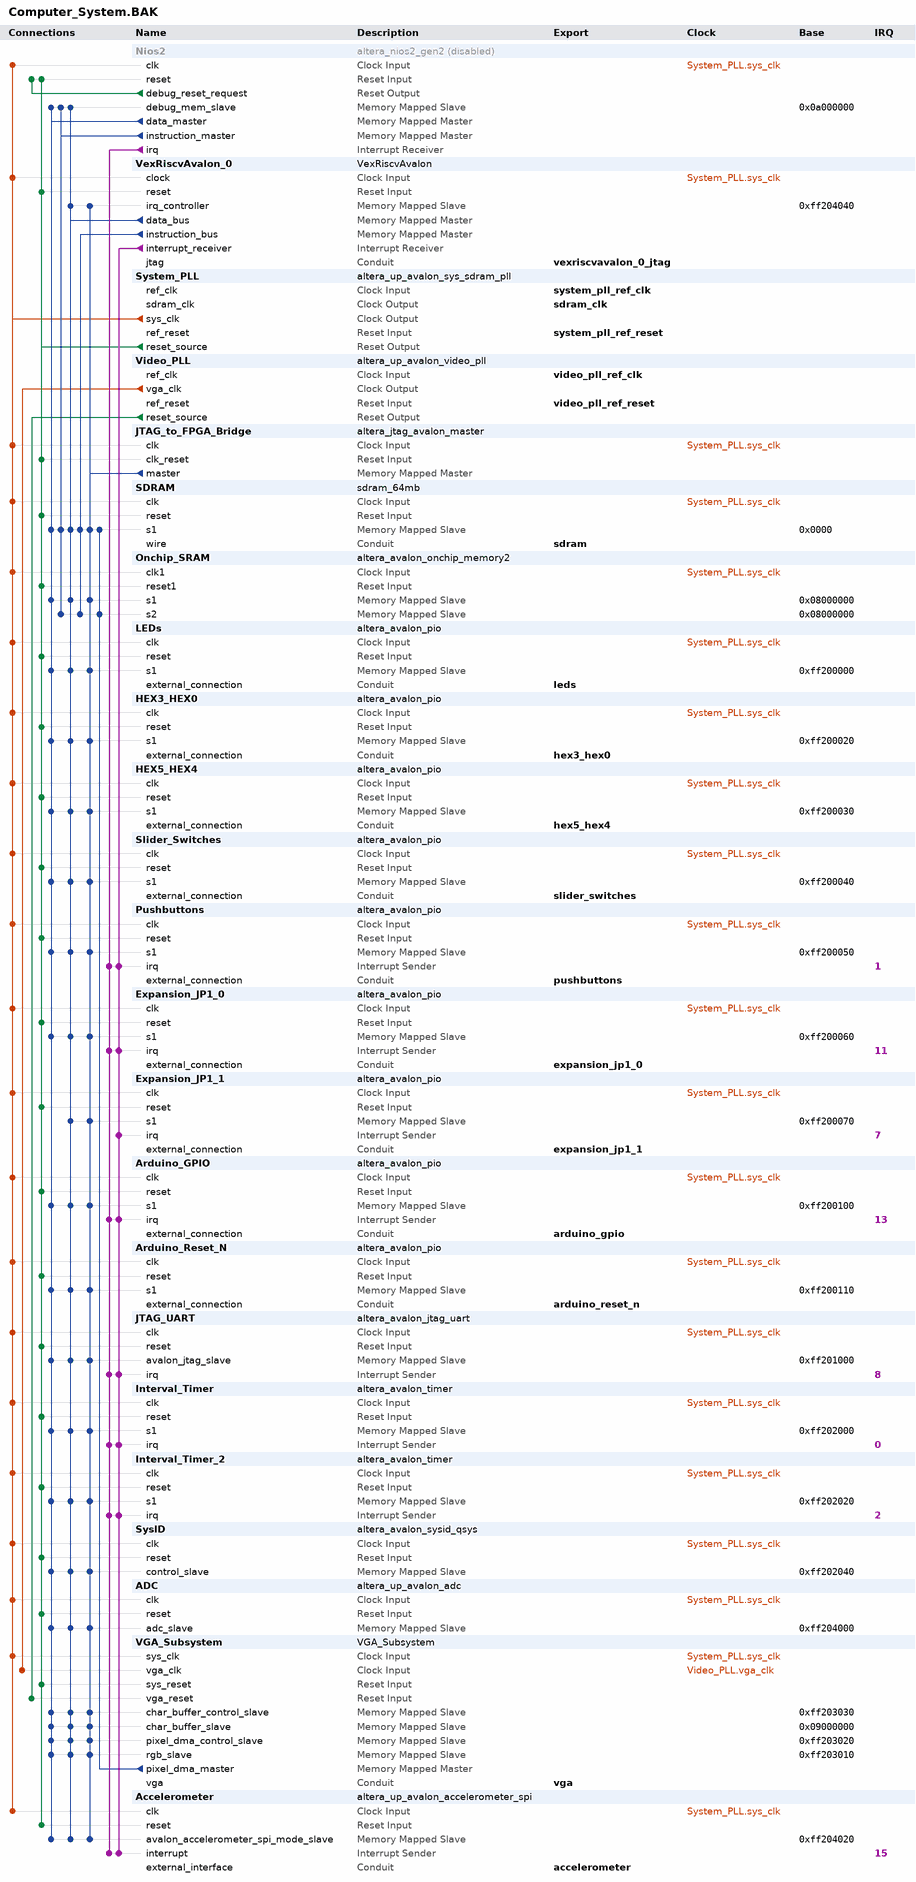
[diagram p0: system contents]
# Platform Designer (Qsys) system Computer_System.BAK, MAX 10 10M50DAF484C6GES
# Parameters at their usual value, and those the tool derives, are not listed.
package require -exact qsys 21.1
create_system Computer_System.BAK
set_project_property DEVICE_FAMILY {MAX 10}
set_project_property DEVICE 10M50DAF484C6GES

add_instance Nios2 altera_nios2_gen2 21.1
set_instance_property Nios2 ENABLED false
set_instance_parameter_value Nios2 dcache_size 0
set_instance_parameter_value Nios2 debug_datatrigger 2
set_instance_parameter_value Nios2 debug_hwbreakpoint 2
set_instance_parameter_value Nios2 debug_traceType instruction_trace
set_instance_parameter_value Nios2 dividerType srt2
set_instance_parameter_value Nios2 exceptionSlave SDRAM.s1
set_instance_parameter_value Nios2 icache_size 4096
set_instance_parameter_value Nios2 impl Fast
set_instance_parameter_value Nios2 mul_64_impl 1
set_instance_parameter_value Nios2 mul_shift_choice 1
set_instance_parameter_value Nios2 resetSlave SDRAM.s1
set_instance_parameter_value Nios2 resetrequest_enabled false
set_instance_parameter_value Nios2 setting_support31bitdcachebypass false

add_instance VexRiscvAvalon_0 VexRiscvAvalon 1.0
set_instance_parameter_value VexRiscvAvalon_0 CORE_CONFIG 4
set_instance_parameter_value VexRiscvAvalon_0 C_EXCEPTION_VECTOR 134217760
set_instance_parameter_value VexRiscvAvalon_0 C_IO_BEGIN 150994944
set_instance_parameter_value VexRiscvAvalon_0 C_IO_END 4294967295
set_instance_parameter_value VexRiscvAvalon_0 C_RESET_VECTOR 134217744

add_instance System_PLL altera_up_avalon_sys_sdram_pll 18.0
set_instance_parameter_value System_PLL CV_boards DE10-Standard
set_instance_parameter_value System_PLL gui_outclk 100.0
set_instance_parameter_value System_PLL gui_refclk 50.0

add_instance Video_PLL altera_up_avalon_video_pll 18.0
set_instance_parameter_value Video_PLL camera {5MP Digital Camera (THDB_D5M)}
set_instance_parameter_value Video_PLL gui_refclk 50.0
set_instance_parameter_value Video_PLL lcd {7" LCD on VEEK-MT and MTL/MTL2 Modules}

add_instance JTAG_to_FPGA_Bridge altera_jtag_avalon_master 21.1

add_instance SDRAM sdram_64mb 1.0

add_instance Onchip_SRAM altera_avalon_onchip_memory2 21.1
set_instance_parameter_value Onchip_SRAM dataWidth 32
set_instance_parameter_value Onchip_SRAM dualPort true
set_instance_parameter_value Onchip_SRAM initMemContent true
set_instance_parameter_value Onchip_SRAM initializationFileName bootrom.mif
set_instance_parameter_value Onchip_SRAM memorySize 65536
set_instance_parameter_value Onchip_SRAM singleClockOperation true
set_instance_parameter_value Onchip_SRAM useNonDefaultInitFile true

add_instance LEDs altera_avalon_pio 21.1
set_instance_parameter_value LEDs direction Output
set_instance_parameter_value LEDs width 10

add_instance HEX3_HEX0 altera_avalon_pio 21.1
set_instance_parameter_value HEX3_HEX0 direction Output
set_instance_parameter_value HEX3_HEX0 width 32

add_instance HEX5_HEX4 altera_avalon_pio 21.1
set_instance_parameter_value HEX5_HEX4 direction Output
set_instance_parameter_value HEX5_HEX4 width 16

add_instance Slider_Switches altera_avalon_pio 21.1
set_instance_parameter_value Slider_Switches direction Input
set_instance_parameter_value Slider_Switches simDoTestBenchWiring true
set_instance_parameter_value Slider_Switches width 10

add_instance Pushbuttons altera_avalon_pio 21.1
set_instance_parameter_value Pushbuttons bitClearingEdgeCapReg true
set_instance_parameter_value Pushbuttons captureEdge true
set_instance_parameter_value Pushbuttons direction Input
set_instance_parameter_value Pushbuttons edgeType FALLING
set_instance_parameter_value Pushbuttons generateIRQ true
set_instance_parameter_value Pushbuttons irqType EDGE
set_instance_parameter_value Pushbuttons simDoTestBenchWiring true
set_instance_parameter_value Pushbuttons width 2

add_instance Expansion_JP1_0 altera_avalon_pio 21.1
set_instance_parameter_value Expansion_JP1_0 bitClearingEdgeCapReg true
set_instance_parameter_value Expansion_JP1_0 captureEdge true
set_instance_parameter_value Expansion_JP1_0 direction Bidir
set_instance_parameter_value Expansion_JP1_0 edgeType FALLING
set_instance_parameter_value Expansion_JP1_0 generateIRQ true
set_instance_parameter_value Expansion_JP1_0 irqType EDGE
set_instance_parameter_value Expansion_JP1_0 simDoTestBenchWiring true
set_instance_parameter_value Expansion_JP1_0 width 18

add_instance Expansion_JP1_1 altera_avalon_pio 21.1
set_instance_parameter_value Expansion_JP1_1 bitClearingEdgeCapReg true
set_instance_parameter_value Expansion_JP1_1 captureEdge true
set_instance_parameter_value Expansion_JP1_1 direction Bidir
set_instance_parameter_value Expansion_JP1_1 edgeType FALLING
set_instance_parameter_value Expansion_JP1_1 generateIRQ true
set_instance_parameter_value Expansion_JP1_1 irqType EDGE
set_instance_parameter_value Expansion_JP1_1 simDoTestBenchWiring true
set_instance_parameter_value Expansion_JP1_1 width 18

add_instance Arduino_GPIO altera_avalon_pio 21.1
set_instance_parameter_value Arduino_GPIO bitClearingEdgeCapReg true
set_instance_parameter_value Arduino_GPIO captureEdge true
set_instance_parameter_value Arduino_GPIO direction Bidir
set_instance_parameter_value Arduino_GPIO edgeType FALLING
set_instance_parameter_value Arduino_GPIO generateIRQ true
set_instance_parameter_value Arduino_GPIO irqType EDGE
set_instance_parameter_value Arduino_GPIO simDoTestBenchWiring true
set_instance_parameter_value Arduino_GPIO width 16

add_instance Arduino_Reset_N altera_avalon_pio 21.1
set_instance_parameter_value Arduino_Reset_N bitClearingEdgeCapReg true
set_instance_parameter_value Arduino_Reset_N captureEdge true
set_instance_parameter_value Arduino_Reset_N direction Output
set_instance_parameter_value Arduino_Reset_N edgeType FALLING
set_instance_parameter_value Arduino_Reset_N width 1

add_instance JTAG_UART altera_avalon_jtag_uart 21.1
set_instance_parameter_value JTAG_UART simInteractiveOptions NO_INTERACTIVE_WINDOWS

add_instance Interval_Timer altera_avalon_timer 21.1
set_instance_parameter_value Interval_Timer period 125.0
set_instance_parameter_value Interval_Timer periodUnits MSEC

add_instance Interval_Timer_2 altera_avalon_timer 21.1
set_instance_parameter_value Interval_Timer_2 period 125.0
set_instance_parameter_value Interval_Timer_2 periodUnits MSEC

add_instance SysID altera_avalon_sysid_qsys 21.1
set_instance_parameter_value SysID id 0

add_instance ADC altera_up_avalon_adc 18.0
set_instance_parameter_value ADC board DE10-Lite
set_instance_parameter_value ADC numch_ 6
set_instance_parameter_value ADC sclk_freq 10.0

add_instance VGA_Subsystem VGA_Subsystem 1.0

add_instance Accelerometer altera_up_avalon_accelerometer_spi 18.0

# connections
add_connection System_PLL.sys_clk Accelerometer.clk clock
add_connection System_PLL.sys_clk ADC.clk clock
add_connection System_PLL.sys_clk Arduino_GPIO.clk clock
add_connection System_PLL.sys_clk Arduino_Reset_N.clk clock
add_connection System_PLL.sys_clk Expansion_JP1_0.clk clock
add_connection System_PLL.sys_clk Expansion_JP1_1.clk clock
add_connection System_PLL.sys_clk HEX3_HEX0.clk clock
add_connection System_PLL.sys_clk HEX5_HEX4.clk clock
add_connection System_PLL.sys_clk Interval_Timer.clk clock
add_connection System_PLL.sys_clk Interval_Timer_2.clk clock
add_connection System_PLL.sys_clk JTAG_to_FPGA_Bridge.clk clock
add_connection System_PLL.sys_clk JTAG_UART.clk clock
add_connection System_PLL.sys_clk LEDs.clk clock
add_connection System_PLL.sys_clk Nios2.clk clock
add_connection System_PLL.sys_clk Onchip_SRAM.clk1 clock
add_connection System_PLL.sys_clk Pushbuttons.clk clock
add_connection System_PLL.sys_clk SDRAM.clk clock
add_connection System_PLL.sys_clk Slider_Switches.clk clock
add_connection System_PLL.sys_clk SysID.clk clock
add_connection System_PLL.sys_clk VexRiscvAvalon_0.clock clock
add_connection System_PLL.sys_clk VGA_Subsystem.sys_clk clock
add_connection Video_PLL.vga_clk VGA_Subsystem.vga_clk clock
add_connection Nios2.debug_reset_request Nios2.reset reset
add_connection System_PLL.reset_source Accelerometer.reset reset
add_connection System_PLL.reset_source ADC.reset reset
add_connection System_PLL.reset_source Arduino_GPIO.reset reset
add_connection System_PLL.reset_source Arduino_Reset_N.reset reset
add_connection System_PLL.reset_source Expansion_JP1_0.reset reset
add_connection System_PLL.reset_source Expansion_JP1_1.reset reset
add_connection System_PLL.reset_source HEX3_HEX0.reset reset
add_connection System_PLL.reset_source HEX5_HEX4.reset reset
add_connection System_PLL.reset_source Interval_Timer.reset reset
add_connection System_PLL.reset_source Interval_Timer_2.reset reset
add_connection System_PLL.reset_source JTAG_to_FPGA_Bridge.clk_reset reset
add_connection System_PLL.reset_source JTAG_UART.reset reset
add_connection System_PLL.reset_source LEDs.reset reset
add_connection System_PLL.reset_source Nios2.reset reset
add_connection System_PLL.reset_source Onchip_SRAM.reset1 reset
add_connection System_PLL.reset_source Pushbuttons.reset reset
add_connection System_PLL.reset_source SDRAM.reset reset
add_connection System_PLL.reset_source Slider_Switches.reset reset
add_connection System_PLL.reset_source SysID.reset reset
add_connection System_PLL.reset_source VexRiscvAvalon_0.reset reset
add_connection System_PLL.reset_source VGA_Subsystem.sys_reset reset
add_connection Video_PLL.reset_source VGA_Subsystem.vga_reset reset
add_connection JTAG_to_FPGA_Bridge.master Accelerometer.avalon_accelerometer_spi_mode_slave avalon
set_connection_parameter_value JTAG_to_FPGA_Bridge.master/Accelerometer.avalon_accelerometer_spi_mode_slave baseAddress 0xff204020
add_connection JTAG_to_FPGA_Bridge.master ADC.adc_slave avalon
set_connection_parameter_value JTAG_to_FPGA_Bridge.master/ADC.adc_slave baseAddress 0xff204000
add_connection JTAG_to_FPGA_Bridge.master Arduino_GPIO.s1 avalon
set_connection_parameter_value JTAG_to_FPGA_Bridge.master/Arduino_GPIO.s1 baseAddress 0xff200100
add_connection JTAG_to_FPGA_Bridge.master Arduino_Reset_N.s1 avalon
set_connection_parameter_value JTAG_to_FPGA_Bridge.master/Arduino_Reset_N.s1 baseAddress 0xff200110
add_connection JTAG_to_FPGA_Bridge.master Expansion_JP1_0.s1 avalon
set_connection_parameter_value JTAG_to_FPGA_Bridge.master/Expansion_JP1_0.s1 baseAddress 0xff200060
add_connection JTAG_to_FPGA_Bridge.master Expansion_JP1_1.s1 avalon
set_connection_parameter_value JTAG_to_FPGA_Bridge.master/Expansion_JP1_1.s1 baseAddress 0xff200070
add_connection JTAG_to_FPGA_Bridge.master HEX3_HEX0.s1 avalon
set_connection_parameter_value JTAG_to_FPGA_Bridge.master/HEX3_HEX0.s1 baseAddress 0xff200020
add_connection JTAG_to_FPGA_Bridge.master HEX5_HEX4.s1 avalon
set_connection_parameter_value JTAG_to_FPGA_Bridge.master/HEX5_HEX4.s1 baseAddress 0xff200030
add_connection JTAG_to_FPGA_Bridge.master Interval_Timer.s1 avalon
set_connection_parameter_value JTAG_to_FPGA_Bridge.master/Interval_Timer.s1 baseAddress 0xff202000
add_connection JTAG_to_FPGA_Bridge.master Interval_Timer_2.s1 avalon
set_connection_parameter_value JTAG_to_FPGA_Bridge.master/Interval_Timer_2.s1 baseAddress 0xff202020
add_connection JTAG_to_FPGA_Bridge.master JTAG_UART.avalon_jtag_slave avalon
set_connection_parameter_value JTAG_to_FPGA_Bridge.master/JTAG_UART.avalon_jtag_slave baseAddress 0xff201000
add_connection JTAG_to_FPGA_Bridge.master LEDs.s1 avalon
set_connection_parameter_value JTAG_to_FPGA_Bridge.master/LEDs.s1 baseAddress 0xff200000
add_connection JTAG_to_FPGA_Bridge.master Onchip_SRAM.s1 avalon
set_connection_parameter_value JTAG_to_FPGA_Bridge.master/Onchip_SRAM.s1 baseAddress 0x08000000
add_connection JTAG_to_FPGA_Bridge.master Pushbuttons.s1 avalon
set_connection_parameter_value JTAG_to_FPGA_Bridge.master/Pushbuttons.s1 baseAddress 0xff200050
add_connection JTAG_to_FPGA_Bridge.master SDRAM.s1 avalon
set_connection_parameter_value JTAG_to_FPGA_Bridge.master/SDRAM.s1 baseAddress 0x0000
add_connection JTAG_to_FPGA_Bridge.master Slider_Switches.s1 avalon
set_connection_parameter_value JTAG_to_FPGA_Bridge.master/Slider_Switches.s1 baseAddress 0xff200040
add_connection JTAG_to_FPGA_Bridge.master SysID.control_slave avalon
set_connection_parameter_value JTAG_to_FPGA_Bridge.master/SysID.control_slave baseAddress 0xff202040
add_connection JTAG_to_FPGA_Bridge.master VexRiscvAvalon_0.irq_controller avalon
set_connection_parameter_value JTAG_to_FPGA_Bridge.master/VexRiscvAvalon_0.irq_controller baseAddress 0xff204040
add_connection JTAG_to_FPGA_Bridge.master VGA_Subsystem.char_buffer_control_slave avalon
set_connection_parameter_value JTAG_to_FPGA_Bridge.master/VGA_Subsystem.char_buffer_control_slave baseAddress 0xff203030
add_connection JTAG_to_FPGA_Bridge.master VGA_Subsystem.char_buffer_slave avalon
set_connection_parameter_value JTAG_to_FPGA_Bridge.master/VGA_Subsystem.char_buffer_slave baseAddress 0x09000000
add_connection JTAG_to_FPGA_Bridge.master VGA_Subsystem.pixel_dma_control_slave avalon
set_connection_parameter_value JTAG_to_FPGA_Bridge.master/VGA_Subsystem.pixel_dma_control_slave baseAddress 0xff203020
add_connection JTAG_to_FPGA_Bridge.master VGA_Subsystem.rgb_slave avalon
set_connection_parameter_value JTAG_to_FPGA_Bridge.master/VGA_Subsystem.rgb_slave baseAddress 0xff203010
add_connection Nios2.data_master Accelerometer.avalon_accelerometer_spi_mode_slave avalon
set_connection_parameter_value Nios2.data_master/Accelerometer.avalon_accelerometer_spi_mode_slave baseAddress 0xff204020
add_connection Nios2.data_master ADC.adc_slave avalon
set_connection_parameter_value Nios2.data_master/ADC.adc_slave baseAddress 0xff204000
add_connection Nios2.data_master Arduino_GPIO.s1 avalon
set_connection_parameter_value Nios2.data_master/Arduino_GPIO.s1 baseAddress 0xff200100
add_connection Nios2.data_master Arduino_Reset_N.s1 avalon
set_connection_parameter_value Nios2.data_master/Arduino_Reset_N.s1 baseAddress 0xff200110
add_connection Nios2.data_master Expansion_JP1_0.s1 avalon
set_connection_parameter_value Nios2.data_master/Expansion_JP1_0.s1 baseAddress 0xff200060
add_connection Nios2.data_master HEX3_HEX0.s1 avalon
set_connection_parameter_value Nios2.data_master/HEX3_HEX0.s1 baseAddress 0xff200020
add_connection Nios2.data_master HEX5_HEX4.s1 avalon
set_connection_parameter_value Nios2.data_master/HEX5_HEX4.s1 baseAddress 0xff200030
add_connection Nios2.data_master Interval_Timer.s1 avalon
set_connection_parameter_value Nios2.data_master/Interval_Timer.s1 baseAddress 0xff202000
add_connection Nios2.data_master Interval_Timer_2.s1 avalon
set_connection_parameter_value Nios2.data_master/Interval_Timer_2.s1 baseAddress 0xff202020
add_connection Nios2.data_master JTAG_UART.avalon_jtag_slave avalon
set_connection_parameter_value Nios2.data_master/JTAG_UART.avalon_jtag_slave baseAddress 0xff201000
add_connection Nios2.data_master LEDs.s1 avalon
set_connection_parameter_value Nios2.data_master/LEDs.s1 baseAddress 0xff200000
add_connection Nios2.data_master Nios2.debug_mem_slave avalon
set_connection_parameter_value Nios2.data_master/Nios2.debug_mem_slave baseAddress 0x0a000000
add_connection Nios2.data_master Onchip_SRAM.s1 avalon
set_connection_parameter_value Nios2.data_master/Onchip_SRAM.s1 baseAddress 0x08000000
add_connection Nios2.data_master Pushbuttons.s1 avalon
set_connection_parameter_value Nios2.data_master/Pushbuttons.s1 baseAddress 0xff200050
add_connection Nios2.data_master SDRAM.s1 avalon
set_connection_parameter_value Nios2.data_master/SDRAM.s1 baseAddress 0x0000
add_connection Nios2.data_master Slider_Switches.s1 avalon
set_connection_parameter_value Nios2.data_master/Slider_Switches.s1 baseAddress 0xff200040
add_connection Nios2.data_master SysID.control_slave avalon
set_connection_parameter_value Nios2.data_master/SysID.control_slave baseAddress 0xff202040
add_connection Nios2.data_master VGA_Subsystem.char_buffer_control_slave avalon
set_connection_parameter_value Nios2.data_master/VGA_Subsystem.char_buffer_control_slave baseAddress 0xff203030
add_connection Nios2.data_master VGA_Subsystem.char_buffer_slave avalon
set_connection_parameter_value Nios2.data_master/VGA_Subsystem.char_buffer_slave baseAddress 0x09000000
add_connection Nios2.data_master VGA_Subsystem.pixel_dma_control_slave avalon
set_connection_parameter_value Nios2.data_master/VGA_Subsystem.pixel_dma_control_slave baseAddress 0xff203020
add_connection Nios2.data_master VGA_Subsystem.rgb_slave avalon
set_connection_parameter_value Nios2.data_master/VGA_Subsystem.rgb_slave baseAddress 0xff203010
add_connection Nios2.instruction_master Nios2.debug_mem_slave avalon
set_connection_parameter_value Nios2.instruction_master/Nios2.debug_mem_slave baseAddress 0x0a000000
add_connection Nios2.instruction_master Onchip_SRAM.s2 avalon
set_connection_parameter_value Nios2.instruction_master/Onchip_SRAM.s2 baseAddress 0x08000000
add_connection Nios2.instruction_master SDRAM.s1 avalon
set_connection_parameter_value Nios2.instruction_master/SDRAM.s1 baseAddress 0x0000
add_connection VexRiscvAvalon_0.data_bus Accelerometer.avalon_accelerometer_spi_mode_slave avalon
set_connection_parameter_value VexRiscvAvalon_0.data_bus/Accelerometer.avalon_accelerometer_spi_mode_slave baseAddress 0xff204020
add_connection VexRiscvAvalon_0.data_bus ADC.adc_slave avalon
set_connection_parameter_value VexRiscvAvalon_0.data_bus/ADC.adc_slave baseAddress 0xff204000
add_connection VexRiscvAvalon_0.data_bus Arduino_GPIO.s1 avalon
set_connection_parameter_value VexRiscvAvalon_0.data_bus/Arduino_GPIO.s1 baseAddress 0xff200100
add_connection VexRiscvAvalon_0.data_bus Arduino_Reset_N.s1 avalon
set_connection_parameter_value VexRiscvAvalon_0.data_bus/Arduino_Reset_N.s1 baseAddress 0xff200110
add_connection VexRiscvAvalon_0.data_bus Expansion_JP1_0.s1 avalon
set_connection_parameter_value VexRiscvAvalon_0.data_bus/Expansion_JP1_0.s1 baseAddress 0xff200060
add_connection VexRiscvAvalon_0.data_bus Expansion_JP1_1.s1 avalon
set_connection_parameter_value VexRiscvAvalon_0.data_bus/Expansion_JP1_1.s1 baseAddress 0xff200070
add_connection VexRiscvAvalon_0.data_bus HEX3_HEX0.s1 avalon
set_connection_parameter_value VexRiscvAvalon_0.data_bus/HEX3_HEX0.s1 baseAddress 0xff200020
add_connection VexRiscvAvalon_0.data_bus HEX5_HEX4.s1 avalon
set_connection_parameter_value VexRiscvAvalon_0.data_bus/HEX5_HEX4.s1 baseAddress 0xff200030
add_connection VexRiscvAvalon_0.data_bus Interval_Timer.s1 avalon
set_connection_parameter_value VexRiscvAvalon_0.data_bus/Interval_Timer.s1 baseAddress 0xff202000
add_connection VexRiscvAvalon_0.data_bus Interval_Timer_2.s1 avalon
set_connection_parameter_value VexRiscvAvalon_0.data_bus/Interval_Timer_2.s1 baseAddress 0xff202020
add_connection VexRiscvAvalon_0.data_bus JTAG_UART.avalon_jtag_slave avalon
set_connection_parameter_value VexRiscvAvalon_0.data_bus/JTAG_UART.avalon_jtag_slave baseAddress 0xff201000
add_connection VexRiscvAvalon_0.data_bus LEDs.s1 avalon
set_connection_parameter_value VexRiscvAvalon_0.data_bus/LEDs.s1 baseAddress 0xff200000
add_connection VexRiscvAvalon_0.data_bus Nios2.debug_mem_slave avalon
set_connection_parameter_value VexRiscvAvalon_0.data_bus/Nios2.debug_mem_slave baseAddress 0x0a000000
add_connection VexRiscvAvalon_0.data_bus Onchip_SRAM.s1 avalon
set_connection_parameter_value VexRiscvAvalon_0.data_bus/Onchip_SRAM.s1 baseAddress 0x08000000
add_connection VexRiscvAvalon_0.data_bus Pushbuttons.s1 avalon
set_connection_parameter_value VexRiscvAvalon_0.data_bus/Pushbuttons.s1 baseAddress 0xff200050
add_connection VexRiscvAvalon_0.data_bus SDRAM.s1 avalon
set_connection_parameter_value VexRiscvAvalon_0.data_bus/SDRAM.s1 baseAddress 0x0000
add_connection VexRiscvAvalon_0.data_bus Slider_Switches.s1 avalon
set_connection_parameter_value VexRiscvAvalon_0.data_bus/Slider_Switches.s1 baseAddress 0xff200040
add_connection VexRiscvAvalon_0.data_bus SysID.control_slave avalon
set_connection_parameter_value VexRiscvAvalon_0.data_bus/SysID.control_slave baseAddress 0xff202040
add_connection VexRiscvAvalon_0.data_bus VexRiscvAvalon_0.irq_controller avalon
set_connection_parameter_value VexRiscvAvalon_0.data_bus/VexRiscvAvalon_0.irq_controller baseAddress 0xff204040
add_connection VexRiscvAvalon_0.data_bus VGA_Subsystem.char_buffer_control_slave avalon
set_connection_parameter_value VexRiscvAvalon_0.data_bus/VGA_Subsystem.char_buffer_control_slave baseAddress 0xff203030
add_connection VexRiscvAvalon_0.data_bus VGA_Subsystem.char_buffer_slave avalon
set_connection_parameter_value VexRiscvAvalon_0.data_bus/VGA_Subsystem.char_buffer_slave baseAddress 0x09000000
add_connection VexRiscvAvalon_0.data_bus VGA_Subsystem.pixel_dma_control_slave avalon
set_connection_parameter_value VexRiscvAvalon_0.data_bus/VGA_Subsystem.pixel_dma_control_slave baseAddress 0xff203020
add_connection VexRiscvAvalon_0.data_bus VGA_Subsystem.rgb_slave avalon
set_connection_parameter_value VexRiscvAvalon_0.data_bus/VGA_Subsystem.rgb_slave baseAddress 0xff203010
add_connection VexRiscvAvalon_0.instruction_bus Onchip_SRAM.s2 avalon
set_connection_parameter_value VexRiscvAvalon_0.instruction_bus/Onchip_SRAM.s2 baseAddress 0x08000000
add_connection VexRiscvAvalon_0.instruction_bus SDRAM.s1 avalon
set_connection_parameter_value VexRiscvAvalon_0.instruction_bus/SDRAM.s1 baseAddress 0x0000
add_connection VGA_Subsystem.pixel_dma_master Onchip_SRAM.s2 avalon
set_connection_parameter_value VGA_Subsystem.pixel_dma_master/Onchip_SRAM.s2 baseAddress 0x08000000
add_connection VGA_Subsystem.pixel_dma_master SDRAM.s1 avalon
set_connection_parameter_value VGA_Subsystem.pixel_dma_master/SDRAM.s1 baseAddress 0x0000
add_connection Nios2.irq Accelerometer.interrupt interrupt
set_connection_parameter_value Nios2.irq/Accelerometer.interrupt irqNumber 15
add_connection Nios2.irq Arduino_GPIO.irq interrupt
set_connection_parameter_value Nios2.irq/Arduino_GPIO.irq irqNumber 13
add_connection Nios2.irq Expansion_JP1_0.irq interrupt
set_connection_parameter_value Nios2.irq/Expansion_JP1_0.irq irqNumber 11
add_connection Nios2.irq Interval_Timer.irq interrupt
set_connection_parameter_value Nios2.irq/Interval_Timer.irq irqNumber 0
add_connection Nios2.irq Interval_Timer_2.irq interrupt
set_connection_parameter_value Nios2.irq/Interval_Timer_2.irq irqNumber 2
add_connection Nios2.irq JTAG_UART.irq interrupt
set_connection_parameter_value Nios2.irq/JTAG_UART.irq irqNumber 8
add_connection Nios2.irq Pushbuttons.irq interrupt
set_connection_parameter_value Nios2.irq/Pushbuttons.irq irqNumber 1
add_connection VexRiscvAvalon_0.interrupt_receiver Accelerometer.interrupt interrupt
set_connection_parameter_value VexRiscvAvalon_0.interrupt_receiver/Accelerometer.interrupt irqNumber 0
add_connection VexRiscvAvalon_0.interrupt_receiver Arduino_GPIO.irq interrupt
set_connection_parameter_value VexRiscvAvalon_0.interrupt_receiver/Arduino_GPIO.irq irqNumber 1
add_connection VexRiscvAvalon_0.interrupt_receiver Expansion_JP1_0.irq interrupt
set_connection_parameter_value VexRiscvAvalon_0.interrupt_receiver/Expansion_JP1_0.irq irqNumber 2
add_connection VexRiscvAvalon_0.interrupt_receiver Expansion_JP1_1.irq interrupt
set_connection_parameter_value VexRiscvAvalon_0.interrupt_receiver/Expansion_JP1_1.irq irqNumber 7
add_connection VexRiscvAvalon_0.interrupt_receiver Interval_Timer.irq interrupt
set_connection_parameter_value VexRiscvAvalon_0.interrupt_receiver/Interval_Timer.irq irqNumber 3
add_connection VexRiscvAvalon_0.interrupt_receiver Interval_Timer_2.irq interrupt
set_connection_parameter_value VexRiscvAvalon_0.interrupt_receiver/Interval_Timer_2.irq irqNumber 4
add_connection VexRiscvAvalon_0.interrupt_receiver JTAG_UART.irq interrupt
set_connection_parameter_value VexRiscvAvalon_0.interrupt_receiver/JTAG_UART.irq irqNumber 5
add_connection VexRiscvAvalon_0.interrupt_receiver Pushbuttons.irq interrupt
set_connection_parameter_value VexRiscvAvalon_0.interrupt_receiver/Pushbuttons.irq irqNumber 6

# exported interfaces
add_interface accelerometer conduit end
set_interface_property accelerometer EXPORT_OF Accelerometer.external_interface
add_interface arduino_gpio conduit end
set_interface_property arduino_gpio EXPORT_OF Arduino_GPIO.external_connection
add_interface arduino_reset_n conduit end
set_interface_property arduino_reset_n EXPORT_OF Arduino_Reset_N.external_connection
add_interface expansion_jp1_0 conduit end
set_interface_property expansion_jp1_0 EXPORT_OF Expansion_JP1_0.external_connection
add_interface expansion_jp1_1 conduit end
set_interface_property expansion_jp1_1 EXPORT_OF Expansion_JP1_1.external_connection
add_interface hex3_hex0 conduit end
set_interface_property hex3_hex0 EXPORT_OF HEX3_HEX0.external_connection
add_interface hex5_hex4 conduit end
set_interface_property hex5_hex4 EXPORT_OF HEX5_HEX4.external_connection
add_interface leds conduit end
set_interface_property leds EXPORT_OF LEDs.external_connection
add_interface pushbuttons conduit end
set_interface_property pushbuttons EXPORT_OF Pushbuttons.external_connection
add_interface sdram conduit end
set_interface_property sdram EXPORT_OF SDRAM.wire
add_interface sdram_clk clock source
set_interface_property sdram_clk EXPORT_OF System_PLL.sdram_clk
add_interface slider_switches conduit end
set_interface_property slider_switches EXPORT_OF Slider_Switches.external_connection
add_interface system_pll_ref_clk clock sink
set_interface_property system_pll_ref_clk EXPORT_OF System_PLL.ref_clk
add_interface system_pll_ref_reset reset sink
set_interface_property system_pll_ref_reset EXPORT_OF System_PLL.ref_reset
add_interface vexriscvavalon_0_jtag conduit end
set_interface_property vexriscvavalon_0_jtag EXPORT_OF VexRiscvAvalon_0.jtag
add_interface vga conduit end
set_interface_property vga EXPORT_OF VGA_Subsystem.vga
add_interface video_pll_ref_clk clock sink
set_interface_property video_pll_ref_clk EXPORT_OF Video_PLL.ref_clk
add_interface video_pll_ref_reset reset sink
set_interface_property video_pll_ref_reset EXPORT_OF Video_PLL.ref_reset

set_interconnect_requirement {$system} qsys_mm.clockCrossingAdapter HANDSHAKE
set_interconnect_requirement {$system} qsys_mm.enableEccProtection FALSE
set_interconnect_requirement {$system} qsys_mm.insertDefaultSlave FALSE
set_interconnect_requirement {$system} qsys_mm.maxAdditionalLatency 1

save_system Computer_System.BAK.qsys
